# Altium project KISS_400AN.PrjPcb
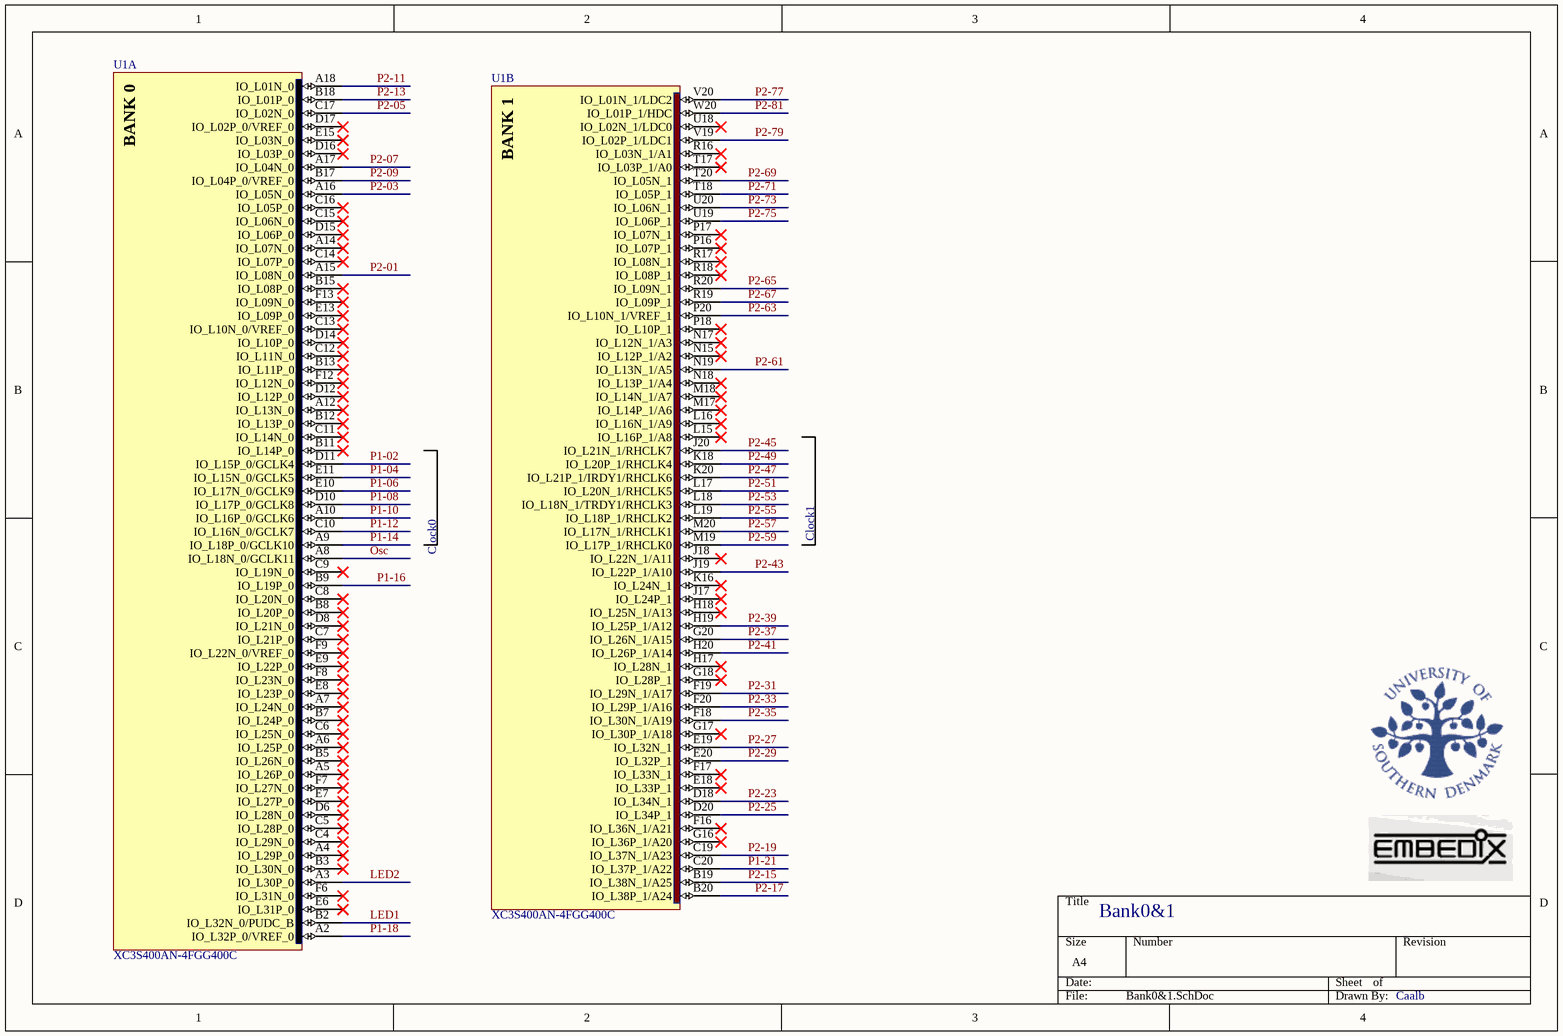
[diagram p0: Bank0&1.SchDoc]
4 sheets, 56 parts. Net scope: global (net labels, ports and power ports of the same name join across sheets).
Board file: PCB2.PcbDoc
Sheets:
  Bank0&1.SchDoc
  Bank2&3.SchDoc
  Power.SchDoc
  Connectors.SchDoc

## Sheet Bank0&1.SchDoc
size A4

### Parts
U1  XC3S400AN-4FGG400C  [FGG400]  (parts A,B of 8)

### Nets
LED1: U1.B2(IO_L32N_0/PUDC_B)
LED2: U1.A3(IO_L30P_0)
Osc: U1.A8(IO_L18N_0/GCLK11)
P1-02: U1.D11(IO_L15P_0/GCLK4)
P1-04: U1.E11(IO_L15N_0/GCLK5)
P1-06: U1.E10(IO_L17N_0/GCLK9)
P1-08: U1.D10(IO_L17P_0/GCLK8)
P1-10: U1.A10(IO_L16P_0/GCLK6)
P1-12: U1.C10(IO_L16N_0/GCLK7)
P1-14: U1.A9(IO_L18P_0/GCLK10)
P1-16: U1.B9(IO_L19P_0)
P1-18: U1.A2(IO_L32P_0/VREF_0)
P1-21: U1.C20(IO_L37P_1/A22)
P2-01: U1.A15(IO_L08N_0)
P2-03: U1.A16(IO_L05N_0)
P2-05: U1.C17(IO_L02N_0)
P2-07: U1.A17(IO_L04N_0)
P2-09: U1.B17(IO_L04P_0/VREF_0)
P2-11: U1.A18(IO_L01N_0)
P2-13: U1.B18(IO_L01P_0)
P2-15: U1.B19(IO_L38N_1/A25)
P2-17: U1.B20(IO_L38P_1/A24)
P2-19: U1.C19(IO_L37N_1/A23)
P2-23: U1.D18(IO_L34N_1)
P2-25: U1.D20(IO_L34P_1)
P2-27: U1.E19(IO_L32N_1)
P2-29: U1.E20(IO_L32P_1)
P2-31: U1.F19(IO_L29N_1/A17)
P2-33: U1.F20(IO_L29P_1/A16)
P2-35: U1.F18(IO_L30N_1/A19)
P2-37: U1.G20(IO_L26N_1/A15)
P2-39: U1.H19(IO_L25P_1/A12)
P2-41: U1.H20(IO_L26P_1/A14)
P2-43: U1.J19(IO_L22P_1/A10)
P2-45: U1.J20(IO_L21N_1/RHCLK7)
P2-47: U1.K20(IO_L21P_1/IRDY1/RHCLK6)
P2-49: U1.K18(IO_L20P_1/RHCLK4)
P2-51: U1.L17(IO_L20N_1/RHCLK5)
P2-53: U1.L18(IO_L18N_1/TRDY1/RHCLK3)
P2-55: U1.L19(IO_L18P_1/RHCLK2)
P2-57: U1.M20(IO_L17N_1/RHCLK1)
P2-59: U1.M19(IO_L17P_1/RHCLK0)
P2-61: U1.N19(IO_L13N_1/A5)
P2-63: U1.P20(IO_L10N_1/VREF_1)
P2-65: U1.R20(IO_L09N_1)
P2-67: U1.R19(IO_L09P_1)
P2-69: U1.T20(IO_L05N_1)
P2-71: U1.T18(IO_L05P_1)
P2-73: U1.U20(IO_L06N_1)
P2-75: U1.U19(IO_L06P_1)
P2-77: U1.V20(IO_L01N_1/LDC2)
P2-79: U1.V19(IO_L02P_1/LDC1)
P2-81: U1.W20(IO_L01P_1/HDC)

Not connected (* = marked no-connect by the designer): U1 A4(IO_L29P_0)* A5(IO_L26P_0)* A6(IO_L25P_0)* A7(IO_L24N_0)* A12(IO_L13N_0)* A14(IO_L07N_0)* B3(IO_L30N_0)* B5(IO_L26N_0)* B7(IO_L24P_0)* B8(IO_L20P_0)* B11(IO_L14P_0)* B12(IO_L13P_0)* B13(IO_L11P_0)* B15(IO_L08P_0)* C4(IO_L29N_0)* C5(IO_L28P_0)* C6(IO_L25N_0)* C7(IO_L21P_0)* C8(IO_L20N_0)* C9(IO_L19N_0)* C11(IO_L14N_0)* C12(IO_L11N_0)* C13(IO_L10N_0/VREF_0)* C14(IO_L07P_0)* C15(IO_L06N_0)* C16(IO_L05P_0)* D6(IO_L28N_0)* D8(IO_L21N_0)* D12(IO_L12P_0)* D14(IO_L10P_0)* D15(IO_L06P_0)* D16(IO_L03P_0)* D17(IO_L02P_0/VREF_0)* E6(IO_L31P_0)* E7(IO_L27P_0)* E8(IO_L23P_0)* E9(IO_L22P_0)* E13(IO_L09P_0)* E15(IO_L03N_0)* E18(IO_L33P_1)* F6(IO_L31N_0)* F7(IO_L27N_0)* F8(IO_L23N_0)* F9(IO_L22N_0/VREF_0)* F12(IO_L12N_0)* F13(IO_L09N_0)* F16(IO_L36N_1/A21)* F17(IO_L33N_1)* G16(IO_L36P_1/A20)* G17(IO_L30P_1/A18)* G18(IO_L28P_1)* H17(IO_L28N_1)* H18(IO_L25N_1/A13)* J17(IO_L24P_1)* J18(IO_L22N_1/A11)* K16(IO_L24N_1)* L15(IO_L16P_1/A8)* L16(IO_L16N_1/A9)* M17(IO_L14P_1/A6)* M18(IO_L14N_1/A7)* N15(IO_L12P_1/A2)* N17(IO_L12N_1/A3)* N18(IO_L13P_1/A4)* P16(IO_L07P_1)* P17(IO_L07N_1)* P18(IO_L10P_1)* R16(IO_L03N_1/A1)* R17(IO_L08N_1)* R18(IO_L08P_1)* T17(IO_L03P_1/A0)* U18(IO_L02N_1/LDC0)*

### Notes on the sheet
- Clock0
- Clock1
- Bank0&1
- Caalb
- (in symbol XC3S400AN-4FGG400C, part A) BANK 0
- (in symbol XC3S400AN-4FGG400C, part B) BANK 1

### Library data of the parts
U1 = XC3S400AN-4FGG400C: Spartan-3AN Non-Volatile FPGA, 311 User I/Os, 400-Pin FBGA, Standard Performance, Commercial Grade, Pb-Free; Published: 20-Jul-2007; DatasheetVersion: 26-Feb-2007; PackageVersion: ver1.0, Mar-2005; PackageReference: FGG400; Publisher: Altium Limited; PackageDescription: 400-Ball Fine Pitch Ball Grid Array 1.00 mm Pitch (FGG400) - Pb-Free; Code_JEDEC: MS-034-AAH-1; Code_IPC: BGA100P20X20-400; ComponentLink1Description: Manufacturer Link; ComponentLink1URL: http://www.xilinx.com/products/silicon_solutions/fpgas/spartan_series/spartan3an_fpgas/index.htm; ComponentLink2Description: Datasheet; ComponentLink2URL: http://direct.xilinx.com/bvdocs/publications/ds557.pdf

## Sheet Bank2&3.SchDoc
size A4
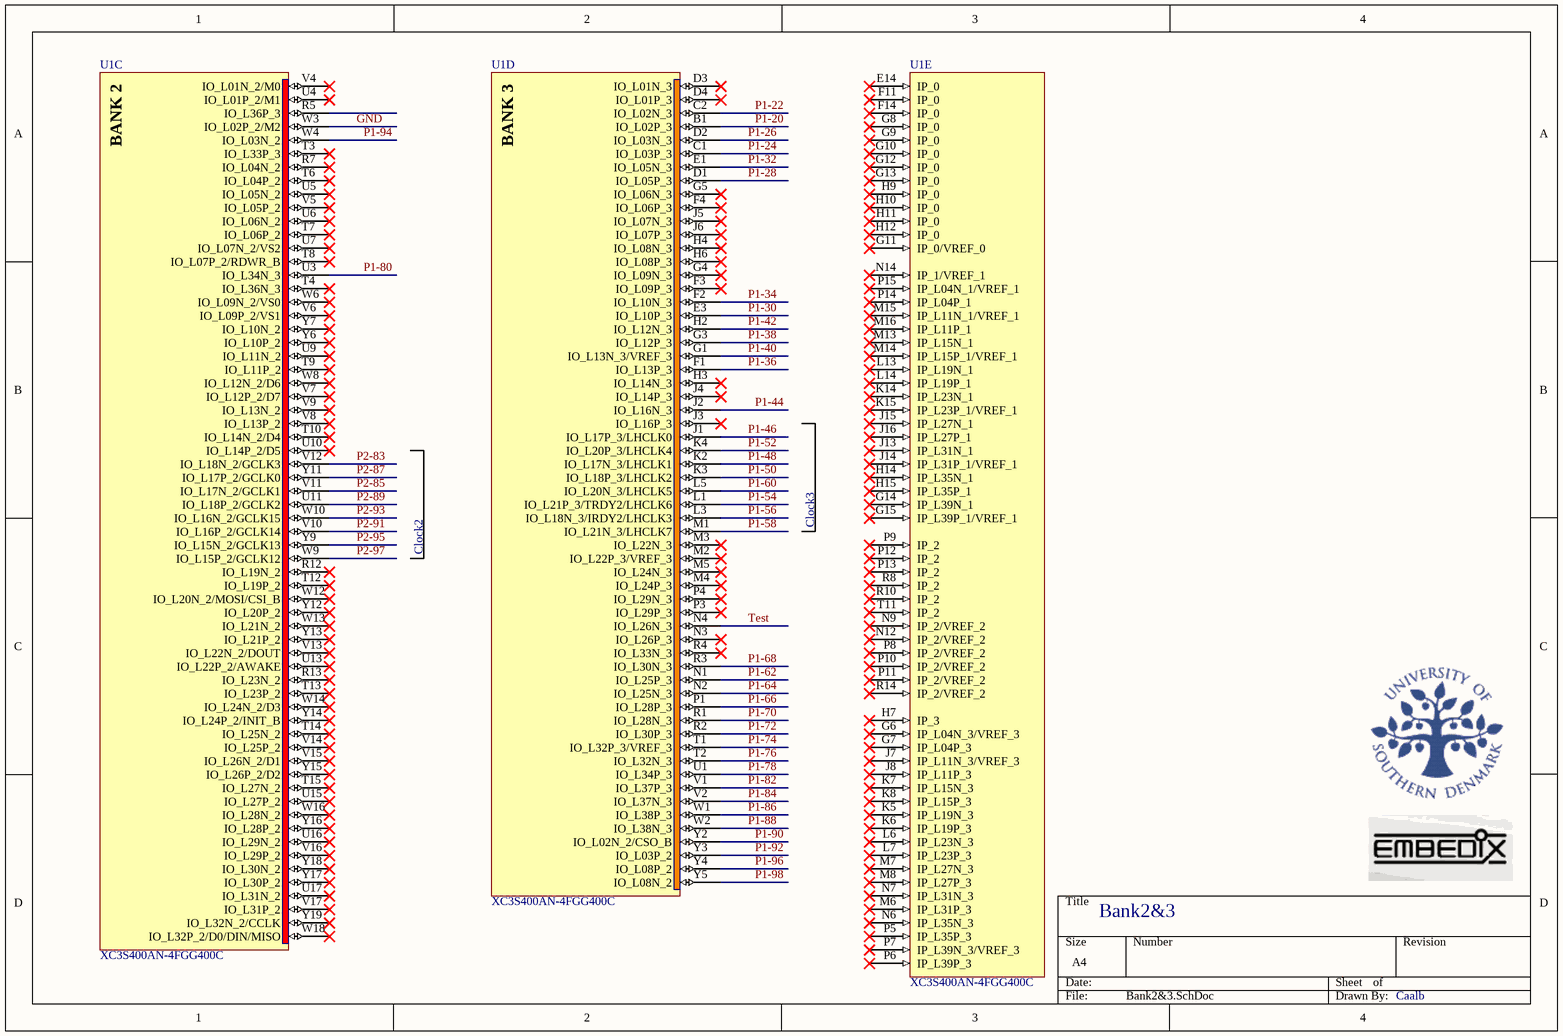
[diagram p1: Bank2&3.SchDoc]

### Parts
U1  XC3S400AN-4FGG400C  [FGG400]  (parts C,D,E of 8)

### Nets
GND: U1.W3(IO_L02P_2/M2)
P1-20: U1.B1(IO_L02P_3)
P1-22: U1.C2(IO_L02N_3)
P1-24: U1.C1(IO_L03P_3)
P1-26: U1.D2(IO_L03N_3)
P1-28: U1.D1(IO_L05P_3)
P1-30: U1.E3(IO_L10P_3)
P1-32: U1.E1(IO_L05N_3)
P1-34: U1.F2(IO_L10N_3)
P1-36: U1.F1(IO_L13P_3)
P1-38: U1.G3(IO_L12P_3)
P1-40: U1.G1(IO_L13N_3/VREF_3)
P1-42: U1.H2(IO_L12N_3)
P1-44: U1.J2(IO_L16N_3)
P1-46: U1.J1(IO_L17P_3/LHCLK0)
P1-48: U1.K2(IO_L17N_3/LHCLK1)
P1-50: U1.K3(IO_L18P_3/LHCLK2)
P1-52: U1.K4(IO_L20P_3/LHCLK4)
P1-54: U1.L1(IO_L21P_3/TRDY2/LHCLK6)
P1-56: U1.L3(IO_L18N_3/IRDY2/LHCLK3)
P1-58: U1.M1(IO_L21N_3/LHCLK7)
P1-60: U1.L5(IO_L20N_3/LHCLK5)
P1-62: U1.N1(IO_L25P_3)
P1-64: U1.N2(IO_L25N_3)
P1-66: U1.P1(IO_L28P_3)
P1-68: U1.R3(IO_L30N_3)
P1-70: U1.R1(IO_L28N_3)
P1-72: U1.R2(IO_L30P_3)
P1-74: U1.T1(IO_L32P_3/VREF_3)
P1-76: U1.T2(IO_L32N_3)
P1-78: U1.U1(IO_L34P_3)
P1-80: U1.U3(IO_L34N_3)
P1-82: U1.V1(IO_L37P_3)
P1-84: U1.V2(IO_L37N_3)
P1-86: U1.W1(IO_L38P_3)
P1-88: U1.W2(IO_L38N_3)
P1-90: U1.Y2(IO_L02N_2/CSO_B)
P1-92: U1.Y3(IO_L03P_2)
P1-94: U1.W4(IO_L03N_2)
P1-96: U1.Y4(IO_L08P_2)
P1-98: U1.Y5(IO_L08N_2)
P2-83: U1.V12(IO_L18N_2/GCLK3)
P2-85: U1.V11(IO_L17N_2/GCLK1)
P2-87: U1.Y11(IO_L17P_2/GCLK0)
P2-89: U1.U11(IO_L18P_2/GCLK2)
P2-91: U1.V10(IO_L16P_2/GCLK14)
P2-93: U1.W10(IO_L16N_2/GCLK15)
P2-95: U1.Y9(IO_L15N_2/GCLK13)
P2-97: U1.W9(IO_L15P_2/GCLK12)
Test: U1.N4(IO_L26N_3)

Not connected (* = marked no-connect by the designer): U1 D3(IO_L01N_3)* D4(IO_L01P_3)* E14(IP_0)* F3(IO_L09P_3)* F4(IO_L06P_3)* F11(IP_0)* F14(IP_0)* G4(IO_L09N_3)* G5(IO_L06N_3)* G6(IP_L04N_3/VREF_3)* G7(IP_L04P_3)* G8(IP_0)* G9(IP_0)* G10(IP_0)* G11(IP_0/VREF_0)* G12(IP_0)* G13(IP_0)* G14(IP_L39N_1)* G15(IP_L39P_1/VREF_1)* H3(IO_L14N_3)* H4(IO_L08N_3)* H6(IO_L08P_3)* H7(IP_3)* H9(IP_0)* H10(IP_0)* H11(IP_0)* H12(IP_0)* H14(IP_L35N_1)* H15(IP_L35P_1)* J3(IO_L16P_3)* J4(IO_L14P_3)* J5(IO_L07N_3)* J6(IO_L07P_3)* J7(IP_L11N_3/VREF_3)* J8(IP_L11P_3)* J13(IP_L31N_1)* J14(IP_L31P_1/VREF_1)* J15(IP_L27N_1)* J16(IP_L27P_1)* K5(IP_L19N_3)* K6(IP_L19P_3)* K7(IP_L15N_3)* K8(IP_L15P_3)* K14(IP_L23N_1)* K15(IP_L23P_1/VREF_1)* L6(IP_L23N_3)* L7(IP_L23P_3)* L13(IP_L19N_1)* L14(IP_L19P_1)* M2(IO_L22P_3/VREF_3)* M3(IO_L22N_3)* M4(IO_L24P_3)* M5(IO_L24N_3)* M6(IP_L31P_3)* M7(IP_L27N_3)* M8(IP_L27P_3)* M13(IP_L15N_1)* M14(IP_L15P_1/VREF_1)* M15(IP_L11N_1/VREF_1)* M16(IP_L11P_1)* N3(IO_L26P_3)* N6(IP_L35N_3)* N7(IP_L31N_3)* N9(IP_2/VREF_2)* N12(IP_2/VREF_2)* N14(IP_1/VREF_1)* P3(IO_L29P_3)* P4(IO_L29N_3)* P5(IP_L35P_3)* P6(IP_L39P_3)* P7(IP_L39N_3/VREF_3)* P8(IP_2/VREF_2)* P9(IP_2)* P10(IP_2/VREF_2)* P11(IP_2/VREF_2)* P12(IP_2)* P13(IP_2)* P14(IP_L04P_1)* P15(IP_L04N_1/VREF_1)* R4(IO_L33N_3)* R5(IO_L36P_3) R7(IO_L04N_2)* R8(IP_2)* R10(IP_2)* R12(IO_L19N_2)* R13(IO_L23N_2)* R14(IP_2/VREF_2)* T3(IO_L33P_3)* T4(IO_L36N_3)* T6(IO_L04P_2)* T7(IO_L06P_2)* T8(IO_L07P_2/RDWR_B)* T9(IO_L11P_2)* T10(IO_L14N_2/D4)* T11(IP_2)* T12(IO_L19P_2)* T13(IO_L23P_2)* T14(IO_L25N_2)* T15(IO_L27N_2)* U4(IO_L01P_2/M1)* U5(IO_L05N_2)* U6(IO_L06N_2)* U7(IO_L07N_2/VS2)* U9(IO_L11N_2)* U10(IO_L14P_2/D5)* U13(IO_L22P_2/AWAKE)* U15(IO_L27P_2)* U16(IO_L29N_2)* U17(IO_L31N_2)* V4(IO_L01N_2/M0)* V5(IO_L05P_2)* V6(IO_L09P_2/VS1)* V7(IO_L12P_2/D7)* V8(IO_L13P_2)* V9(IO_L13N_2)* V13(IO_L22N_2/DOUT)* V14(IO_L25P_2)* V15(IO_L26N_2/D1)* V16(IO_L29P_2)* V17(IO_L31P_2)* W6(IO_L09N_2/VS0)* W8(IO_L12N_2/D6)* W12(IO_L20N_2/MOSI/CSI_B)* W13(IO_L21N_2)* W14(IO_L24N_2/D3)* W16(IO_L28N_2)* W18(IO_L32P_2/D0/DIN/MISO)* Y6(IO_L10P_2)* Y7(IO_L10N_2)* Y12(IO_L20P_2)* Y13(IO_L21P_2)* Y14(IO_L24P_2/INIT_B)* Y15(IO_L26P_2/D2)* Y16(IO_L28P_2)* Y17(IO_L30P_2)* Y18(IO_L30N_2)* Y19(IO_L32N_2/CCLK)*

### Notes on the sheet
- Clock2
- Clock3
- Bank2&3
- Caalb
- (in symbol XC3S400AN-4FGG400C, part C) BANK 2
- (in symbol XC3S400AN-4FGG400C, part D) BANK 3

### Library data of the parts
U1 = XC3S400AN-4FGG400C: as U1 on sheet Bank0&1; Published: 20-Jul-2007; DatasheetVersion: 26-Feb-2007; PackageVersion: ver1.0, Mar-2005; PackageReference: FGG400; Publisher: Altium Limited; PackageDescription: 400-Ball Fine Pitch Ball Grid Array 1.00 mm Pitch (FGG400) - Pb-Free; Code_JEDEC: MS-034-AAH-1; Code_IPC: BGA100P20X20-400; ComponentLink1Description: Manufacturer Link; ComponentLink1URL: http://www.xilinx.com/products/silicon_solutions/fpgas/spartan_series/spartan3an_fpgas/index.htm; ComponentLink2Description: Datasheet; ComponentLink2URL: http://direct.xilinx.com/bvdocs/publications/ds557.pdf

## Sheet Power.SchDoc
size A4
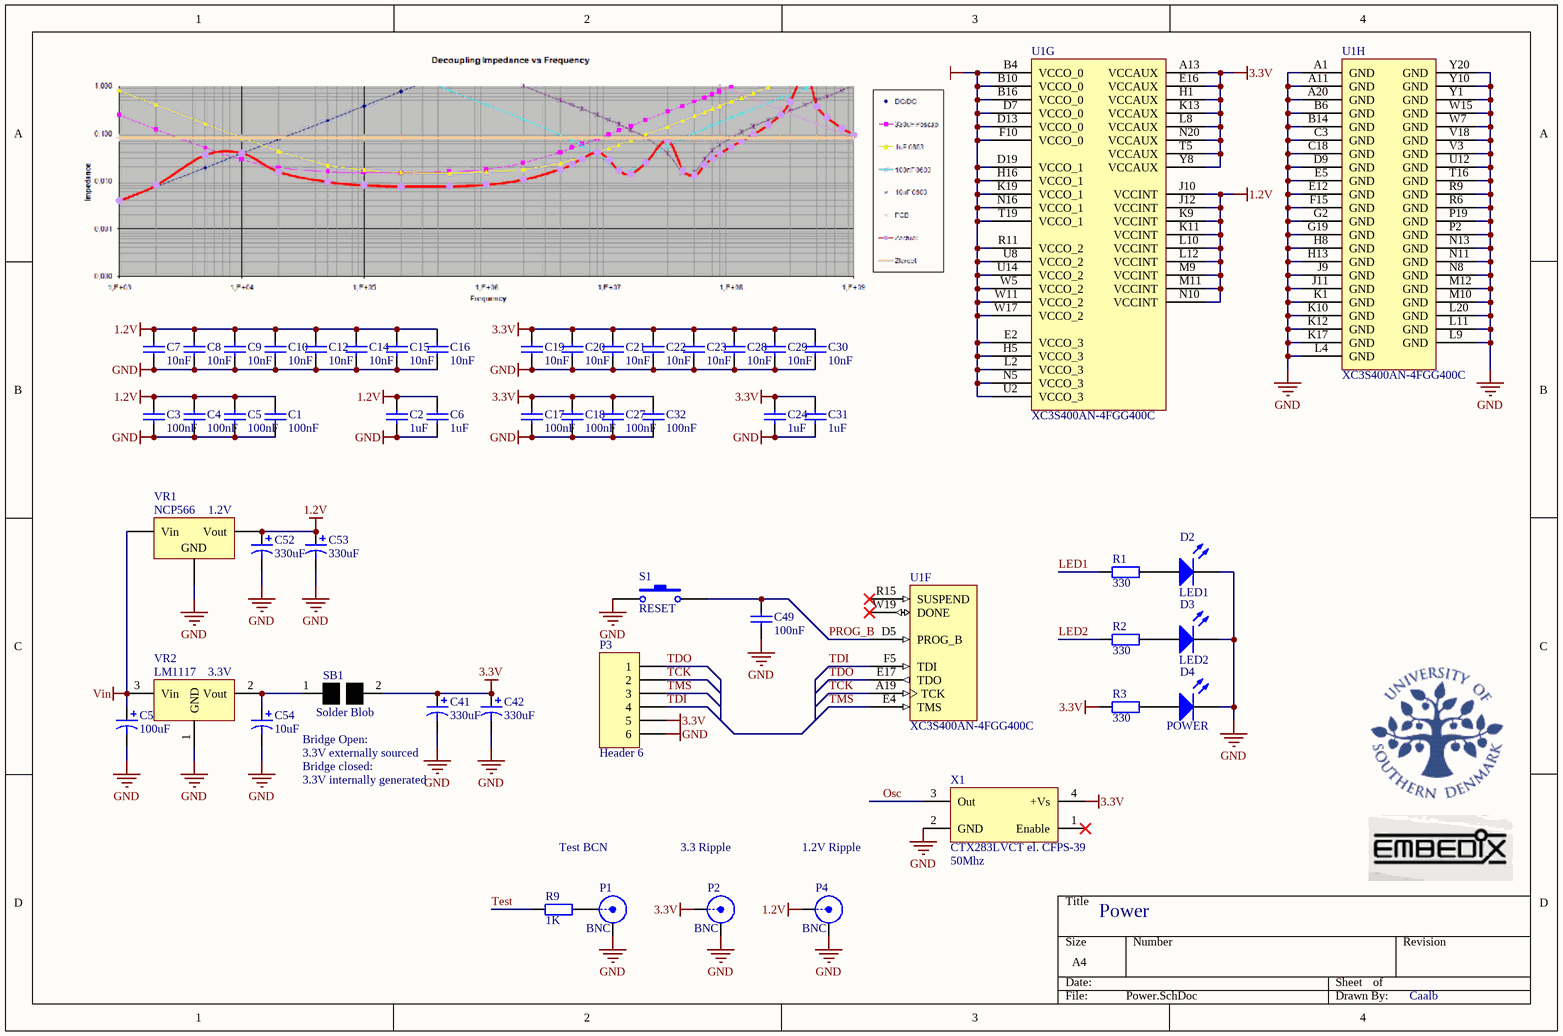
[diagram p2: Power.SchDoc]

### Parts
C1  value 100nF  [0603]  (hidden comment: Cap)
C2  value 1uF  [0603]  (hidden comment: Cap)
C3  value 100nF  [0603]  (hidden comment: Cap)
C4  value 100nF  [0603]  (hidden comment: Cap)
C5  value 100nF  [0603]  (hidden comment: Cap)
C6  value 1uF  [0603]  (hidden comment: Cap)
C7  value 10nF  [0603]  (hidden comment: Cap)
C8  value 10nF  [0603]  (hidden comment: Cap)
C9  value 10nF  [0603]  (hidden comment: Cap)
C10  value 10nF  [0603]  (hidden comment: Cap)
C12  value 10nF  [0603]  (hidden comment: Cap)
C14  value 10nF  [0603]  (hidden comment: Cap)
C15  value 10nF  [0603]  (hidden comment: Cap)
C16  value 10nF  [0603]  (hidden comment: Cap)
C17  value 100nF  [0603]  (hidden comment: Cap)
C18  value 100nF  [0603]  (hidden comment: Cap)
C19  value 10nF  [0603]  (hidden comment: Cap)
C20  value 10nF  [0603]  (hidden comment: Cap)
C21  value 10nF  [0603]  (hidden comment: Cap)
C22  value 10nF  [0603]  (hidden comment: Cap)
C23  value 10nF  [0603]  (hidden comment: Cap)
C24  value 1uF  [0603]  (hidden comment: Cap)
C27  value 100nF  [0603]  (hidden comment: Cap)
C28  value 10nF  [0603]  (hidden comment: Cap)
C29  value 10nF  [0603]  (hidden comment: Cap)
C30  value 10nF  [0603]  (hidden comment: Cap)
C31  value 1uF  [0603]  (hidden comment: Cap)
C32  value 100nF  [0603]  (hidden comment: Cap)
C41  value 330uF  [Tantal size X]  (hidden comment: Cap Pol1)
C42  value 330uF  [Tantal size X]  (hidden comment: Cap Pol1)
C49  value 100nF  [0603]  (hidden comment: Cap)
C51  value 100uF  [Tantal size X]  (hidden comment: Cap Pol1)
C52  value 330uF  [Tantal size X]  (hidden comment: Cap Pol1)
C53  value 330uF  [Tantal size X]  (hidden comment: Cap Pol1)
C54  value 10uF  [1206Pol]  (hidden comment: Cap Pol1)
D2  LED1  [LED0805]
D3  LED2  [LED0805]
D4  POWER  [LED0805]
P1  BNC  [Miniature Coaxial Connectors]
P2  BNC  [Miniature Coaxial Connectors]
P3  Header 6  [HDR1X6]
P4  BNC  [Miniature Coaxial Connectors]
R1  value 330  [0805]  (hidden comment: Res2)
R2  value 330  [0805]  (hidden comment: Res2)
R3  value 330  [0805]  (hidden comment: Res2)
R9  value 1K  [0603]  (hidden comment: Res2)
S1  RESET  [B3U-3000P]
SB1  Solder Blob  [0805 v.solder_blob]
U1  XC3S400AN-4FGG400C  [FGG400]  (parts F,G,H of 8)
VR1  NCP566  value 1.2V  [SOT-223]
VR2  LM1117  value 3.3V  [SOT-223]
X1  CTX283LVCT el. CFPS-39  value 50Mhz  [CB3LV-3C-50M0000]

### Nets
1.2V: C1.2 C2.2 C3.2 C4.2 C5.2 C6.2 C7.2 C8.2 C9.2 C10.2 C12.2 C14.2 C15.2 C16.2 C52.1 C53.1 P4.1(X) U1.J10(VCCINT) U1.J12(VCCINT) U1.K9(VCCINT) U1.K11(VCCINT) U1.L10(VCCINT) U1.L12(VCCINT) U1.M9(VCCINT) U1.M11(VCCINT) U1.N10(VCCINT) VR1.3(Vout)
3.3V: C17.2 C18.2 C19.2 C20.2 C21.2 C22.2 C23.2 C24.2 C27.2 C28.2 C29.2 C30.2 C31.2 C32.2 C41.1 C42.1 P2.1(X) P3.5 R3.2 SB1.2 U1.A13(VCCAUX) U1.B4(VCCO_0) U1.B10(VCCO_0) U1.B16(VCCO_0) U1.D7(VCCO_0) U1.D13(VCCO_0) U1.D19(VCCO_1) U1.E2(VCCO_3) U1.E16(VCCAUX) U1.F10(VCCO_0) U1.H1(VCCAUX) U1.H5(VCCO_3) U1.H16(VCCO_1) U1.K13(VCCAUX) U1.K19(VCCO_1) U1.L2(VCCO_3) U1.L8(VCCAUX) U1.N5(VCCO_3) U1.N16(VCCO_1) U1.N20(VCCAUX) U1.R11(VCCO_2) U1.T5(VCCAUX) U1.T19(VCCO_1) U1.U2(VCCO_3) U1.U8(VCCO_2) U1.U14(VCCO_2) U1.W5(VCCO_2) U1.W11(VCCO_2) U1.W17(VCCO_2) U1.Y8(VCCAUX) X1.4(+Vs)
GND: C1.1 C2.1 C3.1 C4.1 C5.1 C6.1 C7.1 C8.1 C9.1 C10.1 C12.1 C14.1 C15.1 C16.1 C17.1 C18.1 C19.1 C20.1 C21.1 C22.1 C23.1 C24.1 C27.1 C28.1 C29.1 C30.1 C31.1 C32.1 C41.2 C42.2 C49.1 C51.2 C52.2 C53.2 C54.2 D2.2(K) D3.2(K) D4.2(K) P1.2(Y) P2.2(Y) P3.6 P4.2(Y) S1.1 U1.A1(GND) U1.A11(GND) U1.A20(GND) U1.B6(GND) U1.B14(GND) U1.C3(GND) U1.C18(GND) U1.D9(GND) U1.E5(GND) U1.E12(GND) U1.F15(GND) U1.G2(GND) U1.G19(GND) U1.H8(GND) U1.H13(GND) U1.J9(GND) U1.J11(GND) U1.K1(GND) U1.K10(GND) U1.K12(GND) U1.K17(GND) U1.L4(GND) U1.L9(GND) U1.L11(GND) U1.L20(GND) U1.M10(GND) U1.M12(GND) U1.N8(GND) U1.N11(GND) U1.N13(GND) U1.P2(GND) U1.P19(GND) U1.R6(GND) U1.R9(GND) U1.T16(GND) U1.U12(GND) U1.V3(GND) U1.V18(GND) U1.W7(GND) U1.W15(GND) U1.Y1(GND) U1.Y10(GND) U1.Y20(GND) VR1.2(GND) VR2.1(GND) X1.2(GND)
Vin: C51.1 VR1.1(Vin) VR2.3(Vin)
LED1: R1.2
LED2: R2.2
Osc: X1.3(Out)
PROG_B: C49.2 S1.2 U1.D5(PROG_B)
TCK: P3.2 U1.A19(TCK)
TDI: P3.4 U1.F5(TDI)
TDO: P3.1 U1.E17(TDO)
Test: R9.1
TMS: P3.3 U1.E4(TMS)
NetC54_1: C54.1 SB1.1 VR2.2(Vout)
NetD2_1: D2.1(A) R1.1
NetD3_1: D3.1(A) R2.1
NetD4_1: D4.1(A) R3.1
NetP1_1: P1.1(X) R9.2

Not connected (* = marked no-connect by the designer): U1 R15(SUSPEND)* W19(DONE)*; X1 1(Enable)*

### Notes on the sheet
- Test BCN
- 3.3 Ripple
- 1.2V Ripple
- Power
- Caalb
- (in symbol Jumper) Bridge Open:; 3.3V externally sourced; Bridge closed:; 3.3V internally generated

### Library data of the parts
C1-C10 C12 C14-C24 C27-C32 C49 = Cap: !Capacitor; Published: 8-Jun-2000; LatestRevisionDate: 17-Jul-2002; LatestRevisionNote: Re-released for DXP Platform.; PackageReference: RAD-0.3; Publisher: Altium Limited
C41 C42 C51-C54 = Cap Pol1: !Polarized Capacitor (Radial); Published: 8-Jun-2000; LatestRevisionDate: 17-Jul-2002; LatestRevisionNote: Re-released for DXP Platform.; PackageReference: RB7.6-15; Publisher: Altium Limited
D2 = LED0: LED; Value: Red; Published: 8-Jun-2000; LatestRevisionDate: 08-Jul-2005; LatestRevisionNote: Mech Layer 1 removed.; PackageReference: RD; Publisher: Altium Limited
D3 = LED0: LED; Value: Yellow; Published: 8-Jun-2000; LatestRevisionDate: 08-Jul-2005; LatestRevisionNote: Mech Layer 1 removed.; PackageReference: GR; Publisher: Altium Limited
D4 = LED0: LED; Value: Green; Published: 8-Jun-2000; LatestRevisionDate: 08-Jul-2005; LatestRevisionNote: Mech Layer 1 removed.; PackageReference: YE; Publisher: Altium Limited
P1 P2 P4 = BNC: Miniature Coaxial Connectors; LatestRevisionDate: 17-Jul-2002; LatestRevisionNote: Re-released for DXP Platform.; Publisher: Altium Limited
P3 = Header 6: Header, 6-Pin; LatestRevisionDate: 17-Jul-2002; LatestRevisionNote: Re-released for DXP Platform.; Publisher: Altium Limited
R1-R3 R9 = Res2: !Resistor; Published: 8-Jun-2000; Publisher: Altium Limited
  R1-R3: LatestRevisionDate: 17-Jul-2002; LatestRevisionNote: Re-released for DXP Platform.; PackageReference: AXIAL-0.4
  R9: Revision: July-2002: Re-released for DXP Platform.
S1 = SW-PB: Switch; Published: 24-Mar-1999; LatestRevisionDate: 17-Jul-2002; LatestRevisionNote: Re-released for DXP Platform.; PackageReference: SPST-2; Publisher: Altium Limited
SB1 = Jumper
U1 = XC3S400AN-4FGG400C: as U1 on sheet Bank0&1; Published: 20-Jul-2007; DatasheetVersion: 26-Feb-2007; PackageVersion: ver1.0, Mar-2005; PackageReference: FGG400; Publisher: Altium Limited; PackageDescription: 400-Ball Fine Pitch Ball Grid Array 1.00 mm Pitch (FGG400) - Pb-Free; Code_JEDEC: MS-034-AAH-1; Code_IPC: BGA100P20X20-400; ComponentLink1Description: Manufacturer Link; ComponentLink1URL: http://www.xilinx.com/products/silicon_solutions/fpgas/spartan_series/spartan3an_fpgas/index.htm; ComponentLink2Description: Datasheet; ComponentLink2URL: http://direct.xilinx.com/bvdocs/publications/ds557.pdf
VR1 = Volt Reg: Volt Reg NCP566; Published: 24-Mar-1999; LatestRevisionDate: 17-Jul-2002; LatestRevisionNote: Re-released for DXP Platform.; PackageReference: D2PAK; Publisher: Altium Limited; Code_JEDEC: SMD-220
VR2 = LM1117: 800mA Low-Dropout Linear Regulator
X1 = CFPS-39: 3.3V, ultra minature surface mount oscillator

## Sheet Connectors.SchDoc
size A4
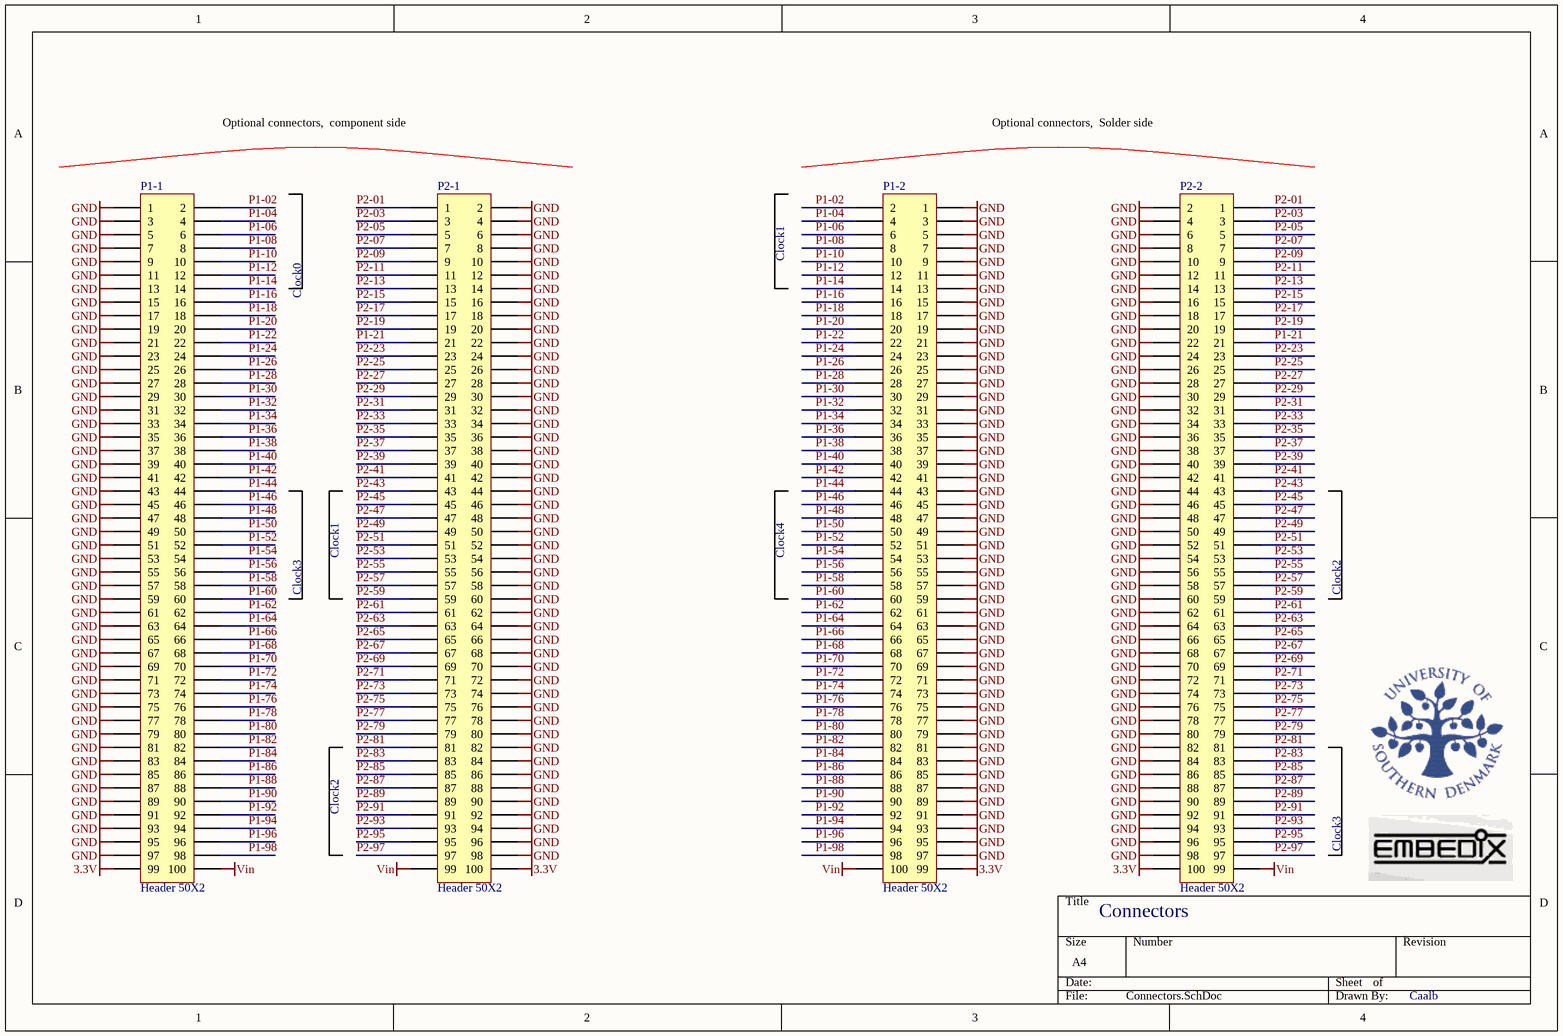
[diagram p3: Connectors.SchDoc]

### Parts
P1-1  Header 50X2  [FX8C-100S-SV(91)]
P1-2  Header 50X2  [FX8C-100P-SV6(91)]
P2-1  Header 50X2  [FX8C-100S-SV(91)]
P2-2  Header 50X2  [FX8C-100P-SV6(91)]

### Nets
3.3V: P1-1.99 P1-2.99 P2-1.100 P2-2.100
GND: P1-1.1 P1-1.3 P1-1.5 P1-1.7 P1-1.9 P1-1.11 P1-1.13 P1-1.15 P1-1.17 P1-1.19 P1-1.21 P1-1.23 P1-1.25 P1-1.27 P1-1.29 P1-1.31 P1-1.33 P1-1.35 P1-1.37 P1-1.39 P1-1.41 P1-1.43 P1-1.45 P1-1.47 P1-1.49 P1-1.51 P1-1.53 P1-1.55 P1-1.57 P1-1.59 P1-1.61 P1-1.63 P1-1.65 P1-1.67 P1-1.69 P1-1.71 P1-1.73 P1-1.75 P1-1.77 P1-1.79 P1-1.81 P1-1.83 P1-1.85 P1-1.87 P1-1.89 P1-1.91 P1-1.93 P1-1.95 P1-1.97 P1-2.1 P1-2.3 P1-2.5 P1-2.7 P1-2.9 P1-2.11 P1-2.13 P1-2.15 P1-2.17 P1-2.19 P1-2.21 P1-2.23 P1-2.25 P1-2.27 P1-2.29 P1-2.31 P1-2.33 P1-2.35 P1-2.37 P1-2.39 P1-2.41 P1-2.43 P1-2.45 P1-2.47 P1-2.49 P1-2.51 P1-2.53 P1-2.55 P1-2.57 P1-2.59 P1-2.61 P1-2.63 P1-2.65 P1-2.67 P1-2.69 P1-2.71 P1-2.73 P1-2.75 P1-2.77 P1-2.79 P1-2.81 P1-2.83 P1-2.85 P1-2.87 P1-2.89 P1-2.91 P1-2.93 P1-2.95 P1-2.97 P2-1.2 P2-1.4 P2-1.6 P2-1.8 P2-1.10 P2-1.12 P2-1.14 P2-1.16 P2-1.18 P2-1.20 P2-1.22 P2-1.24 P2-1.26 P2-1.28 P2-1.30 P2-1.32 P2-1.34 P2-1.36 P2-1.38 P2-1.40 P2-1.42 P2-1.44 P2-1.46 P2-1.48 P2-1.50 P2-1.52 P2-1.54 P2-1.56 P2-1.58 P2-1.60 P2-1.62 P2-1.64 P2-1.66 P2-1.68 P2-1.70 P2-1.72 P2-1.74 P2-1.76 P2-1.78 P2-1.80 P2-1.82 P2-1.84 P2-1.86 P2-1.88 P2-1.90 P2-1.92 P2-1.94 P2-1.96 P2-1.98 P2-2.2 P2-2.4 P2-2.6 P2-2.8 P2-2.10 P2-2.12 P2-2.14 P2-2.16 P2-2.18 P2-2.20 P2-2.22 P2-2.24 P2-2.26 P2-2.28 P2-2.30 P2-2.32 P2-2.34 P2-2.36 P2-2.38 P2-2.40 P2-2.42 P2-2.44 P2-2.46 P2-2.48 P2-2.50 P2-2.52 P2-2.54 P2-2.56 P2-2.58 P2-2.60 P2-2.62 P2-2.64 P2-2.66 P2-2.68 P2-2.70 P2-2.72 P2-2.74 P2-2.76 P2-2.78 P2-2.80 P2-2.82 P2-2.84 P2-2.86 P2-2.88 P2-2.90 P2-2.92 P2-2.94 P2-2.96 P2-2.98
Vin: P1-1.100 P1-2.100 P2-1.99 P2-2.99
P1-02: P1-1.2 P1-2.2
P1-04: P1-1.4 P1-2.4
P1-06: P1-1.6 P1-2.6
P1-08: P1-1.8 P1-2.8
P1-10: P1-1.10 P1-2.10
P1-12: P1-1.12 P1-2.12
P1-14: P1-1.14 P1-2.14
P1-16: P1-1.16 P1-2.16
P1-18: P1-1.18 P1-2.18
P1-20: P1-1.20 P1-2.20
P1-21: P2-1.21 P2-2.21
P1-22: P1-1.22 P1-2.22
P1-24: P1-1.24 P1-2.24
P1-26: P1-1.26 P1-2.26
P1-28: P1-1.28 P1-2.28
P1-30: P1-1.30 P1-2.30
P1-32: P1-1.32 P1-2.32
P1-34: P1-1.34 P1-2.34
P1-36: P1-1.36 P1-2.36
P1-38: P1-1.38 P1-2.38
P1-40: P1-1.40 P1-2.40
P1-42: P1-1.42 P1-2.42
P1-44: P1-1.44 P1-2.44
P1-46: P1-1.46 P1-2.46
P1-48: P1-1.48 P1-2.48
P1-50: P1-1.50 P1-2.50
P1-52: P1-1.52 P1-2.52
P1-54: P1-1.54 P1-2.54
P1-56: P1-1.56 P1-2.56
P1-58: P1-1.58 P1-2.58
P1-60: P1-1.60 P1-2.60
P1-62: P1-1.62 P1-2.62
P1-64: P1-1.64 P1-2.64
P1-66: P1-1.66 P1-2.66
P1-68: P1-1.68 P1-2.68
P1-70: P1-1.70 P1-2.70
P1-72: P1-1.72 P1-2.72
P1-74: P1-1.74 P1-2.74
P1-76: P1-1.76 P1-2.76
P1-78: P1-1.78 P1-2.78
P1-80: P1-1.80 P1-2.80
P1-82: P1-1.82 P1-2.82
P1-84: P1-1.84 P1-2.84
P1-86: P1-1.86 P1-2.86
P1-88: P1-1.88 P1-2.88
P1-90: P1-1.90 P1-2.90
P1-92: P1-1.92 P1-2.92
P1-94: P1-1.94 P1-2.94
P1-96: P1-1.96 P1-2.96
P1-98: P1-1.98 P1-2.98
P2-01: P2-1.1 P2-2.1
P2-03: P2-1.3 P2-2.3
P2-05: P2-1.5 P2-2.5
P2-07: P2-1.7 P2-2.7
P2-09: P2-1.9 P2-2.9
P2-11: P2-1.11 P2-2.11
P2-13: P2-1.13 P2-2.13
P2-15: P2-1.15 P2-2.15
P2-17: P2-1.17 P2-2.17
P2-19: P2-1.19 P2-2.19
P2-23: P2-1.23 P2-2.23
P2-25: P2-1.25 P2-2.25
P2-27: P2-1.27 P2-2.27
P2-29: P2-1.29 P2-2.29
P2-31: P2-1.31 P2-2.31
P2-33: P2-1.33 P2-2.33
P2-35: P2-1.35 P2-2.35
P2-37: P2-1.37 P2-2.37
P2-39: P2-1.39 P2-2.39
P2-41: P2-1.41 P2-2.41
P2-43: P2-1.43 P2-2.43
P2-45: P2-1.45 P2-2.45
P2-47: P2-1.47 P2-2.47
P2-49: P2-1.49 P2-2.49
P2-51: P2-1.51 P2-2.51
P2-53: P2-1.53 P2-2.53
P2-55: P2-1.55 P2-2.55
P2-57: P2-1.57 P2-2.57
P2-59: P2-1.59 P2-2.59
P2-61: P2-1.61 P2-2.61
P2-63: P2-1.63 P2-2.63
P2-65: P2-1.65 P2-2.65
P2-67: P2-1.67 P2-2.67
P2-69: P2-1.69 P2-2.69
P2-71: P2-1.71 P2-2.71
P2-73: P2-1.73 P2-2.73
P2-75: P2-1.75 P2-2.75
P2-77: P2-1.77 P2-2.77
P2-79: P2-1.79 P2-2.79
P2-81: P2-1.81 P2-2.81
P2-83: P2-1.83 P2-2.83
P2-85: P2-1.85 P2-2.85
P2-87: P2-1.87 P2-2.87
P2-89: P2-1.89 P2-2.89
P2-91: P2-1.91 P2-2.91
P2-93: P2-1.93 P2-2.93
P2-95: P2-1.95 P2-2.95
P2-97: P2-1.97 P2-2.97

### Notes on the sheet
- Optional connectors,  component side
- Optional connectors,  Solder side
- Clock0
- Clock1
- Clock3
- Clock4
- Clock2
- (near P2-2) Connectors
- Caalb

### Library data of the parts
P1-1 P2-1 = Header 50X2: FX8C-100S-SV(91); LatestRevisionDate: 17-Jul-2002; LatestRevisionNote: Re-released for DXP Platform.; Publisher: Altium Limited
P1-2 P2-2 = Header 50X2: FX8C-100P-SV6(91); LatestRevisionDate: 17-Jul-2002; LatestRevisionNote: Re-released for DXP Platform.; Publisher: Altium Limited

## Nets that join several sheets
3.3V: Power (51 pins), Connectors (P1-1.99 P1-2.99 P2-1.100 P2-2.100)
GND: Bank2&3 (U1.W3), Power (89 pins), Connectors (196 pins)
Vin: Power (C51.1 VR1.1 VR2.3), Connectors (P1-1.100 P1-2.100 P2-1.99 P2-2.99)
LED1: Bank0&1 (U1.B2), Power (R1.2)
LED2: Bank0&1 (U1.A3), Power (R2.2)
Osc: Bank0&1 (U1.A8), Power (X1.3)
P1-02: Bank0&1 (U1.D11), Connectors (P1-1.2 P1-2.2)
P1-04: Bank0&1 (U1.E11), Connectors (P1-1.4 P1-2.4)
P1-06: Bank0&1 (U1.E10), Connectors (P1-1.6 P1-2.6)
P1-08: Bank0&1 (U1.D10), Connectors (P1-1.8 P1-2.8)
P1-10: Bank0&1 (U1.A10), Connectors (P1-1.10 P1-2.10)
P1-12: Bank0&1 (U1.C10), Connectors (P1-1.12 P1-2.12)
P1-14: Bank0&1 (U1.A9), Connectors (P1-1.14 P1-2.14)
P1-16: Bank0&1 (U1.B9), Connectors (P1-1.16 P1-2.16)
P1-18: Bank0&1 (U1.A2), Connectors (P1-1.18 P1-2.18)
P1-20: Bank2&3 (U1.B1), Connectors (P1-1.20 P1-2.20)
P1-21: Bank0&1 (U1.C20), Connectors (P2-1.21 P2-2.21)
P1-22: Bank2&3 (U1.C2), Connectors (P1-1.22 P1-2.22)
P1-24: Bank2&3 (U1.C1), Connectors (P1-1.24 P1-2.24)
P1-26: Bank2&3 (U1.D2), Connectors (P1-1.26 P1-2.26)
P1-28: Bank2&3 (U1.D1), Connectors (P1-1.28 P1-2.28)
P1-30: Bank2&3 (U1.E3), Connectors (P1-1.30 P1-2.30)
P1-32: Bank2&3 (U1.E1), Connectors (P1-1.32 P1-2.32)
P1-34: Bank2&3 (U1.F2), Connectors (P1-1.34 P1-2.34)
P1-36: Bank2&3 (U1.F1), Connectors (P1-1.36 P1-2.36)
P1-38: Bank2&3 (U1.G3), Connectors (P1-1.38 P1-2.38)
P1-40: Bank2&3 (U1.G1), Connectors (P1-1.40 P1-2.40)
P1-42: Bank2&3 (U1.H2), Connectors (P1-1.42 P1-2.42)
P1-44: Bank2&3 (U1.J2), Connectors (P1-1.44 P1-2.44)
P1-46: Bank2&3 (U1.J1), Connectors (P1-1.46 P1-2.46)
P1-48: Bank2&3 (U1.K2), Connectors (P1-1.48 P1-2.48)
P1-50: Bank2&3 (U1.K3), Connectors (P1-1.50 P1-2.50)
P1-52: Bank2&3 (U1.K4), Connectors (P1-1.52 P1-2.52)
P1-54: Bank2&3 (U1.L1), Connectors (P1-1.54 P1-2.54)
P1-56: Bank2&3 (U1.L3), Connectors (P1-1.56 P1-2.56)
P1-58: Bank2&3 (U1.M1), Connectors (P1-1.58 P1-2.58)
P1-60: Bank2&3 (U1.L5), Connectors (P1-1.60 P1-2.60)
P1-62: Bank2&3 (U1.N1), Connectors (P1-1.62 P1-2.62)
P1-64: Bank2&3 (U1.N2), Connectors (P1-1.64 P1-2.64)
P1-66: Bank2&3 (U1.P1), Connectors (P1-1.66 P1-2.66)
P1-68: Bank2&3 (U1.R3), Connectors (P1-1.68 P1-2.68)
P1-70: Bank2&3 (U1.R1), Connectors (P1-1.70 P1-2.70)
P1-72: Bank2&3 (U1.R2), Connectors (P1-1.72 P1-2.72)
P1-74: Bank2&3 (U1.T1), Connectors (P1-1.74 P1-2.74)
P1-76: Bank2&3 (U1.T2), Connectors (P1-1.76 P1-2.76)
P1-78: Bank2&3 (U1.U1), Connectors (P1-1.78 P1-2.78)
P1-80: Bank2&3 (U1.U3), Connectors (P1-1.80 P1-2.80)
P1-82: Bank2&3 (U1.V1), Connectors (P1-1.82 P1-2.82)
P1-84: Bank2&3 (U1.V2), Connectors (P1-1.84 P1-2.84)
P1-86: Bank2&3 (U1.W1), Connectors (P1-1.86 P1-2.86)
P1-88: Bank2&3 (U1.W2), Connectors (P1-1.88 P1-2.88)
P1-90: Bank2&3 (U1.Y2), Connectors (P1-1.90 P1-2.90)
P1-92: Bank2&3 (U1.Y3), Connectors (P1-1.92 P1-2.92)
P1-94: Bank2&3 (U1.W4), Connectors (P1-1.94 P1-2.94)
P1-96: Bank2&3 (U1.Y4), Connectors (P1-1.96 P1-2.96)
P1-98: Bank2&3 (U1.Y5), Connectors (P1-1.98 P1-2.98)
P2-01: Bank0&1 (U1.A15), Connectors (P2-1.1 P2-2.1)
P2-03: Bank0&1 (U1.A16), Connectors (P2-1.3 P2-2.3)
P2-05: Bank0&1 (U1.C17), Connectors (P2-1.5 P2-2.5)
P2-07: Bank0&1 (U1.A17), Connectors (P2-1.7 P2-2.7)
P2-09: Bank0&1 (U1.B17), Connectors (P2-1.9 P2-2.9)
P2-11: Bank0&1 (U1.A18), Connectors (P2-1.11 P2-2.11)
P2-13: Bank0&1 (U1.B18), Connectors (P2-1.13 P2-2.13)
P2-15: Bank0&1 (U1.B19), Connectors (P2-1.15 P2-2.15)
P2-17: Bank0&1 (U1.B20), Connectors (P2-1.17 P2-2.17)
P2-19: Bank0&1 (U1.C19), Connectors (P2-1.19 P2-2.19)
P2-23: Bank0&1 (U1.D18), Connectors (P2-1.23 P2-2.23)
P2-25: Bank0&1 (U1.D20), Connectors (P2-1.25 P2-2.25)
P2-27: Bank0&1 (U1.E19), Connectors (P2-1.27 P2-2.27)
P2-29: Bank0&1 (U1.E20), Connectors (P2-1.29 P2-2.29)
P2-31: Bank0&1 (U1.F19), Connectors (P2-1.31 P2-2.31)
P2-33: Bank0&1 (U1.F20), Connectors (P2-1.33 P2-2.33)
P2-35: Bank0&1 (U1.F18), Connectors (P2-1.35 P2-2.35)
P2-37: Bank0&1 (U1.G20), Connectors (P2-1.37 P2-2.37)
P2-39: Bank0&1 (U1.H19), Connectors (P2-1.39 P2-2.39)
P2-41: Bank0&1 (U1.H20), Connectors (P2-1.41 P2-2.41)
P2-43: Bank0&1 (U1.J19), Connectors (P2-1.43 P2-2.43)
P2-45: Bank0&1 (U1.J20), Connectors (P2-1.45 P2-2.45)
P2-47: Bank0&1 (U1.K20), Connectors (P2-1.47 P2-2.47)
P2-49: Bank0&1 (U1.K18), Connectors (P2-1.49 P2-2.49)
P2-51: Bank0&1 (U1.L17), Connectors (P2-1.51 P2-2.51)
P2-53: Bank0&1 (U1.L18), Connectors (P2-1.53 P2-2.53)
P2-55: Bank0&1 (U1.L19), Connectors (P2-1.55 P2-2.55)
P2-57: Bank0&1 (U1.M20), Connectors (P2-1.57 P2-2.57)
P2-59: Bank0&1 (U1.M19), Connectors (P2-1.59 P2-2.59)
P2-61: Bank0&1 (U1.N19), Connectors (P2-1.61 P2-2.61)
P2-63: Bank0&1 (U1.P20), Connectors (P2-1.63 P2-2.63)
P2-65: Bank0&1 (U1.R20), Connectors (P2-1.65 P2-2.65)
P2-67: Bank0&1 (U1.R19), Connectors (P2-1.67 P2-2.67)
P2-69: Bank0&1 (U1.T20), Connectors (P2-1.69 P2-2.69)
P2-71: Bank0&1 (U1.T18), Connectors (P2-1.71 P2-2.71)
P2-73: Bank0&1 (U1.U20), Connectors (P2-1.73 P2-2.73)
P2-75: Bank0&1 (U1.U19), Connectors (P2-1.75 P2-2.75)
P2-77: Bank0&1 (U1.V20), Connectors (P2-1.77 P2-2.77)
P2-79: Bank0&1 (U1.V19), Connectors (P2-1.79 P2-2.79)
P2-81: Bank0&1 (U1.W20), Connectors (P2-1.81 P2-2.81)
P2-83: Bank2&3 (U1.V12), Connectors (P2-1.83 P2-2.83)
P2-85: Bank2&3 (U1.V11), Connectors (P2-1.85 P2-2.85)
P2-87: Bank2&3 (U1.Y11), Connectors (P2-1.87 P2-2.87)
P2-89: Bank2&3 (U1.U11), Connectors (P2-1.89 P2-2.89)
P2-91: Bank2&3 (U1.V10), Connectors (P2-1.91 P2-2.91)
P2-93: Bank2&3 (U1.W10), Connectors (P2-1.93 P2-2.93)
P2-95: Bank2&3 (U1.Y9), Connectors (P2-1.95 P2-2.95)
P2-97: Bank2&3 (U1.W9), Connectors (P2-1.97 P2-2.97)
Test: Bank2&3 (U1.N4), Power (R9.1)